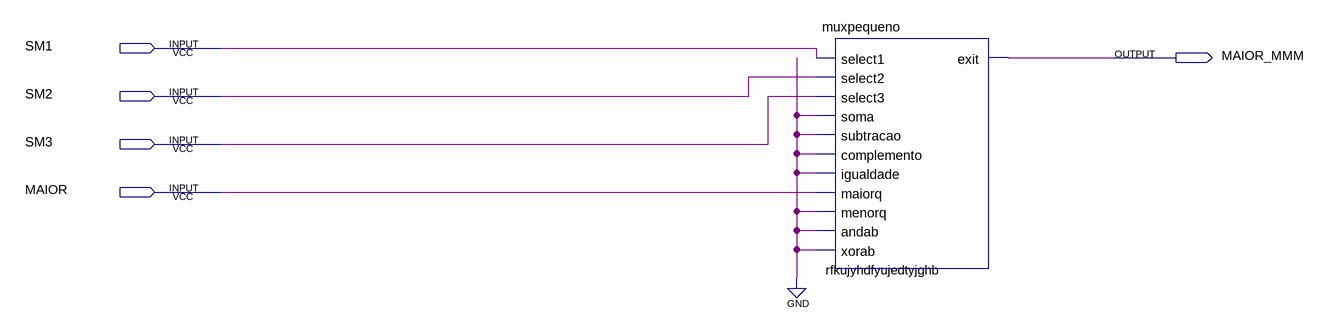
[diagram p0: schematic sheet]
// Quartus schematic MUXMAIOR_QUE.bdf as structural Verilog: 1 symbols, 5 pins
module MUXMAIOR_QUE (
  input  SM1,
  input  SM2,
  input  SM3,
  input  MAIOR,
  output MAIOR_MMM
);

  muxpequeno rfkujyhdfyujedtyjghb (
    .select1(SM1), .select2(SM2), .select3(SM3), .soma(1'b0), .subtracao(1'b0), .complemento(1'b0),
    .igualdade(1'b0), .maiorq(MAIOR), .menorq(1'b0), .andab(1'b0), .xorab(1'b0), .exit(MAIOR_MMM));
endmodule
